# Altium schematic sheet MCU.SchDoc
size A4
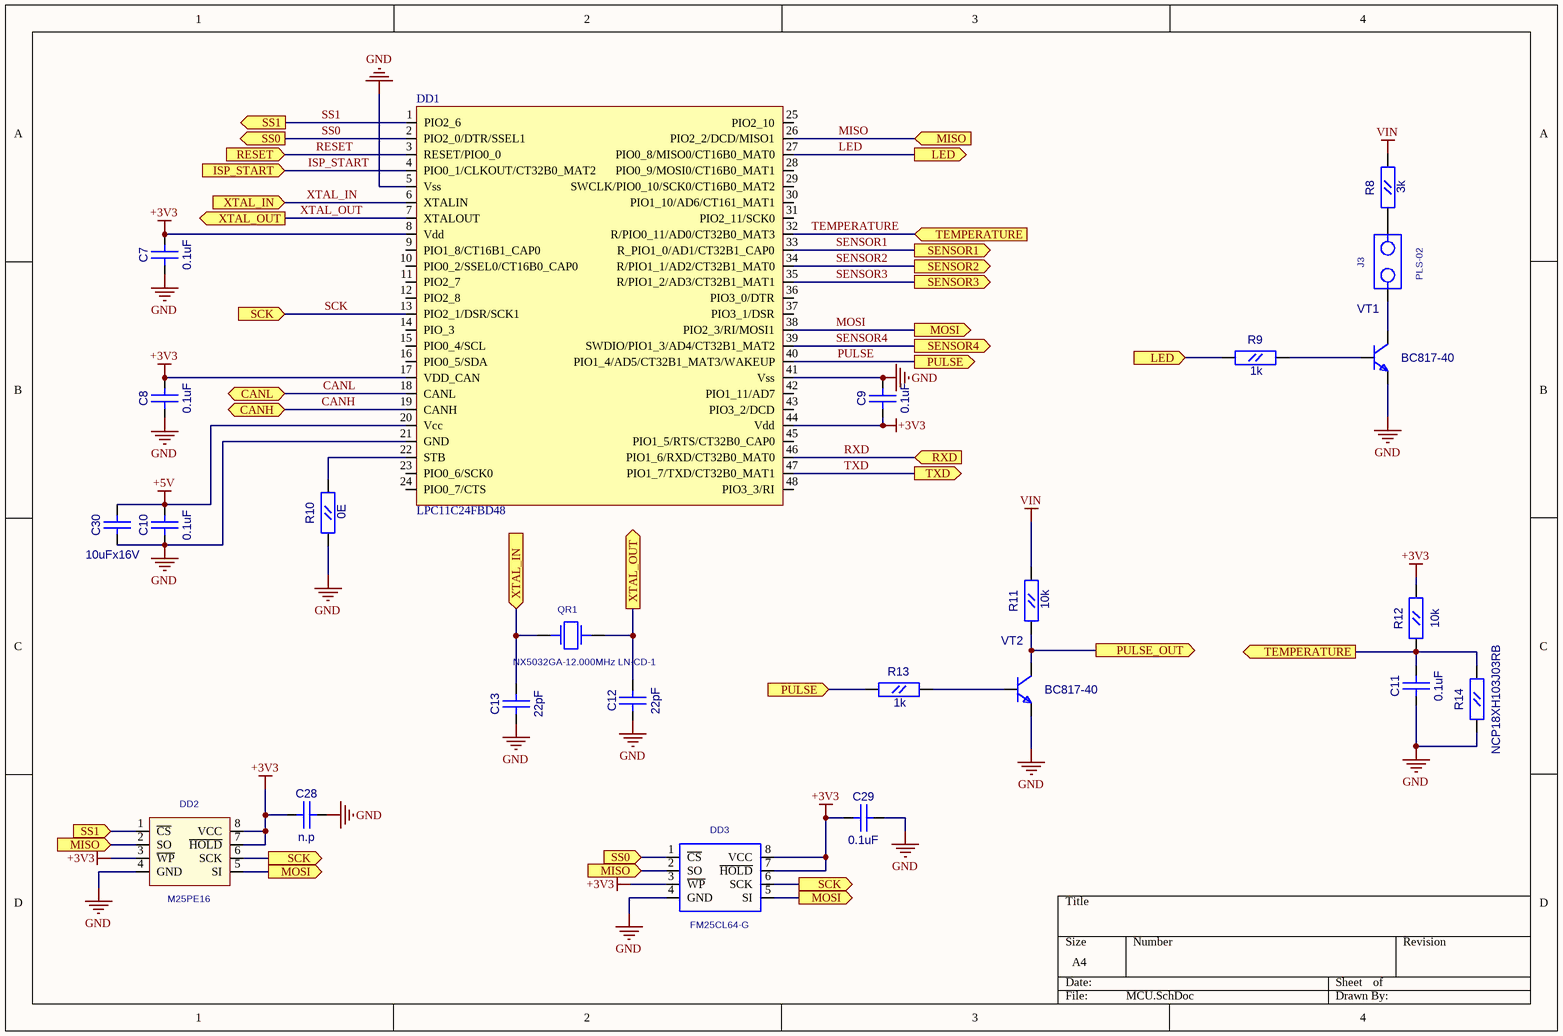
[diagram p0: MCU.SchDoc]

## Parts
C7  0.1uF  [CC0603]
C8  0.1uF  [CC0603]
C9  0.1uF  [CC0603]
C10  0.1uF  [CC0603]
C11  0.1uF  [CC0603]
C12  22pF  [CC0603]
C13  22pF  [CC0603]
C28  n.p  [CC0603]
C29  0.1uF  [CC0603]
C30  10uFx16V  [CC0805]
DD1  LPC11C24FBD48  [LQFP-48]
DD2  M25PE16  [EIAJ_SO8]
DD3  FM25CL64-G  [SO-8]
J3  PLS-02  [PLS-02]
QR1  NX5032GA-12.000MHz LN-CD-1  [AC5032_2]
R8  3k  [RC0603]
R9  1k  [RC0603]
R10  0E  [RC0603]
R11  10k  [RC0603]
R12  10k  [RC0603]
R13  1k  [RC0603]
R14  NCP18XH103J03RB  [RC0603]
VT1  BC817-40  [SOT-23(123)]
VT2  BC817-40  [SOT-23(123)]

## Ports
CANH (bidir), CANL (bidir), ISP_START (in), LED (in), LED (out), MISO (in), MOSI (out), PULSE (in), PULSE (out), PULSE_OUT (out), RESET (in), RXD (in), SCK (in), SCK (out), SENSOR1 (out), SENSOR2 (out), SENSOR3 (out), SENSOR4 (out), SS0 (in), SS0 (out), SS1 (in), SS1 (out), TEMPERATURE (in), TEMPERATURE (out), TXD (out), XTAL_IN (in), XTAL_OUT (out)

## Nets
+3V3: C7.2(B) C8.2(B) C9.1(A) C28.1(A) C29.1(A) DD1.8(Vdd) DD1.17(VDD_CAN) DD1.44(Vdd) DD2.3(~{WP}) DD2.7(~{HOLD}) DD2.8(VCC) DD3.3(~{WP}) DD3.7(~{HOLD}) DD3.8(VCC) R12.2(B)
+5V: C10.2(B) C30.2(B) DD1.20(Vcc)
GND: C7.1(A) C8.1(A) C9.2(B) C10.1(A) C11.1(A) C12.1(A) C13.1(A) C28.2(B) C29.2(B) C30.1(A) DD1.5(Vss) DD1.21(GND) DD1.41(Vss) DD2.4(GND) DD3.4(GND) R10.1(A) R14.1(A) VT1.2(E) VT2.2(E)
VIN: R8.2(B) R11.2(B)
CANH: DD1.19(CANH) ; port CANH
CANL: DD1.18(CANL) ; port CANL
ISP_START: DD1.4(PIO0_1/CLKOUT/CT32B0_MAT2) ; port ISP_START
LED: DD1.27(PIO0_8/MISO0/CT16B0_MAT0) R9.1(A) ; port LED
MISO: DD1.26(PIO2_2/DCD/MISO1) DD2.2(SO) DD3.2(SO) ; port MISO
MOSI: DD1.38(PIO2_3/RI/MOSI1) DD2.5(SI) DD3.5(SI) ; port MOSI
PULSE: DD1.40(PIO1_4/AD5/CT32B1_MAT3/WAKEUP) R13.1(A) ; port PULSE
PULSE_OUT: R11.1(A) VT2.3(C) ; port PULSE_OUT
RESET: DD1.3(RESET/PIO0_0) ; port RESET
RXD: DD1.46(PIO1_6/RXD/CT32B0_MAT0) ; port RXD
SCK: DD1.13(PIO2_1/DSR/SCK1) DD2.6(SCK) DD3.6(SCK) ; port SCK
SENSOR1: DD1.33(R_PIO1_0/AD1/CT32B1_CAP0) ; port SENSOR1
SENSOR2: DD1.34(R/PIO1_1/AD2/CT32B1_MAT0) ; port SENSOR2
SENSOR3: DD1.35(R/PIO1_2/AD3/CT32B1_MAT1) ; port SENSOR3
SENSOR4: DD1.39(SWDIO/PIO1_3/AD4/CT32B1_MAT2) ; port SENSOR4
SS0: DD1.2(PIO2_0/DTR/SSEL1) DD3.1(~{CS}) ; port SS0
SS1: DD1.1(PIO2_6) DD2.1(~{CS}) ; port SS1
TEMPERATURE: C11.2(B) DD1.32(R/PIO0_11/AD0/CT32B0_MAT3) R12.1(A) R14.2(B) ; port TEMPERATURE
TXD: DD1.47(PIO1_7/TXD/CT32B0_MAT1) ; port TXD
XTAL_IN: C13.2(B) DD1.6(XTALIN) QR1.1 ; port XTAL_IN
XTAL_OUT: C12.2(B) DD1.7(XTALOUT) QR1.2 ; port XTAL_OUT
NetDD1_22: DD1.22(STB) R10.2(B)
NetJ3_1: J3.1 VT1.3(C)
NetJ3_2: J3.2 R8.1(A)
NetR9_2: R9.2(B) VT1.1(B)
NetR13_2: R13.2(B) VT2.1(B)

Not connected (* = marked no-connect by the designer): DD1 9(PIO1_8/CT16B1_CAP0) 10(PIO0_2/SSEL0/CT16B0_CAP0) 11(PIO2_7) 12(PIO2_8) 14(PIO_3) 15(PIO0_4/SCL) 16(PIO0_5/SDA) 23(PIO0_6/SCK0) 24(PIO0_7/CTS) 25(PIO2_10) 28(PIO0_9/MOSI0/CT16B0_MAT1) 29(SWCLK/PIO0_10/SCK0/CT16B0_MAT2) 30(PIO1_10/AD6/CT161_MAT1) 31(PIO2_11/SCK0) 36(PIO3_0/DTR) 37(PIO3_1/DSR) 42(PIO1_11/AD7) 43(PIO3_2/DCD) 45(PIO1_5/RTS/CT32B0_CAP0) 48(PIO3_3/RI)

## Library data of the parts
C7-C13 C28 C29 = CC0603
  C7-C11 C29: Value: 0.1uF
  C12 C13: Value: 22pF
  C28: Value: n.p
C30 = CC0805: Value: 10uFx16V
DD2 = S25FL016A0LMFI01: Value: M25PE16
QR1 = AC5032_2: AC5032/2; Value: NX5032GA-12.000MHz LN-CD-1
R8-R14 = RC0603
  R8: Value: 3k
  R9 R13: Value: 1k
  R10: Value: 0E
  R11 R12: Value: 10k
  R14: Value: NCP18XH103J03RB
VT1 VT2 = BC846BLT1: NPN 500ma transistor; ComponentField7: Published 29-Sep-2000; OriginalName: BC846BLT1; Value: BC817-40
DD1 = LPC11C24FBD48: Value: LPC11C24FBD48
DD3 = FM25CL64-G: Value: *
J3 = PLS-02: Value: *